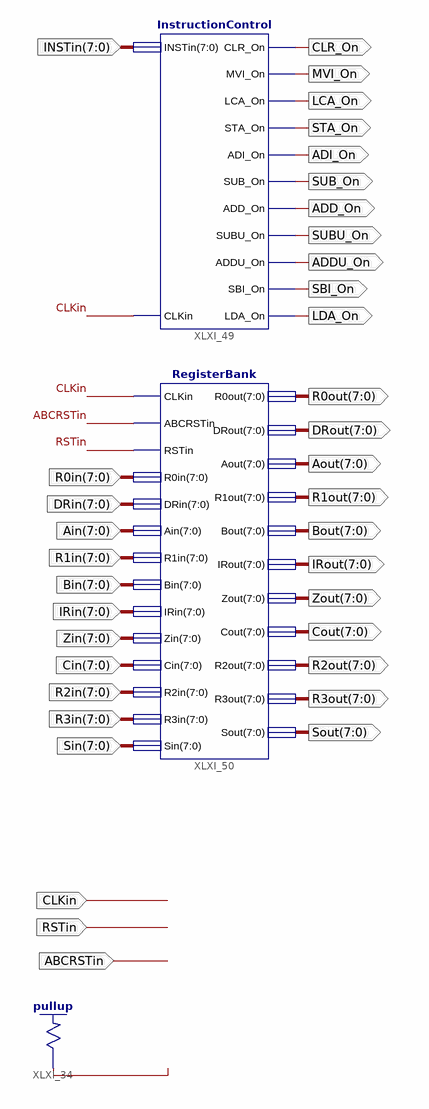
[diagram p0: schematic sheet 1]
// Xilinx ISE schematic ControlUnit.sch (spartan3e) as structural Verilog: 3 symbols, 37 ports
module ControlUnit (
  input  CLKin,
  input  RSTin,
  input  ABCRSTin,
  input  [7:0] INSTin,
  input  [7:0] R0in,
  input  [7:0] DRin,
  input  [7:0] Ain,
  input  [7:0] R1in,
  input  [7:0] Bin,
  input  [7:0] IRin,
  input  [7:0] Zin,
  input  [7:0] Cin,
  input  [7:0] R2in,
  input  [7:0] R3in,
  input  [7:0] Sin,
  output CLR_On,
  output MVI_On,
  output LCA_On,
  output STA_On,
  output ADI_On,
  output SUB_On,
  output ADD_On,
  output SUBU_On,
  output ADDU_On,
  output SBI_On,
  output LDA_On,
  output [7:0] R0out,
  output [7:0] DRout,
  output [7:0] Aout,
  output [7:0] R1out,
  output [7:0] Bout,
  output [7:0] IRout,
  output [7:0] Zout,
  output [7:0] Cout,
  output [7:0] R2out,
  output [7:0] R3out,
  output [7:0] Sout
);

  wire CE;

  \pullup  XLXI_34 (.O(CE));
  InstructionControl XLXI_49 (
    .INSTin(INSTin), .CLKin(CLKin), .CLR_On(CLR_On), .MVI_On(MVI_On), .LCA_On(LCA_On), .STA_On(STA_On),
    .ADI_On(ADI_On), .SUB_On(SUB_On), .ADD_On(ADD_On), .SUBU_On(SUBU_On), .ADDU_On(ADDU_On), .SBI_On(SBI_On),
    .LDA_On(LDA_On));
  RegisterBank XLXI_50 (
    .CLKin(CLKin), .ABCRSTin(ABCRSTin), .RSTin(RSTin), .R0in(R0in), .DRin(DRin), .Ain(Ain), .R1in(R1in),
    .Bin(Bin), .IRin(IRin), .Zin(Zin), .Cin(Cin), .R2in(R2in), .R3in(R3in), .Sin(Sin), .R0out(R0out),
    .DRout(DRout), .Aout(Aout), .R1out(R1out), .Bout(Bout), .IRout(IRout), .Zout(Zout), .Cout(Cout),
    .R2out(R2out), .R3out(R3out), .Sout(Sout));
endmodule
